# Altium schematic sheet micro.SchDoc
size A4; SheetNumber: 1; SheetTotal: 3
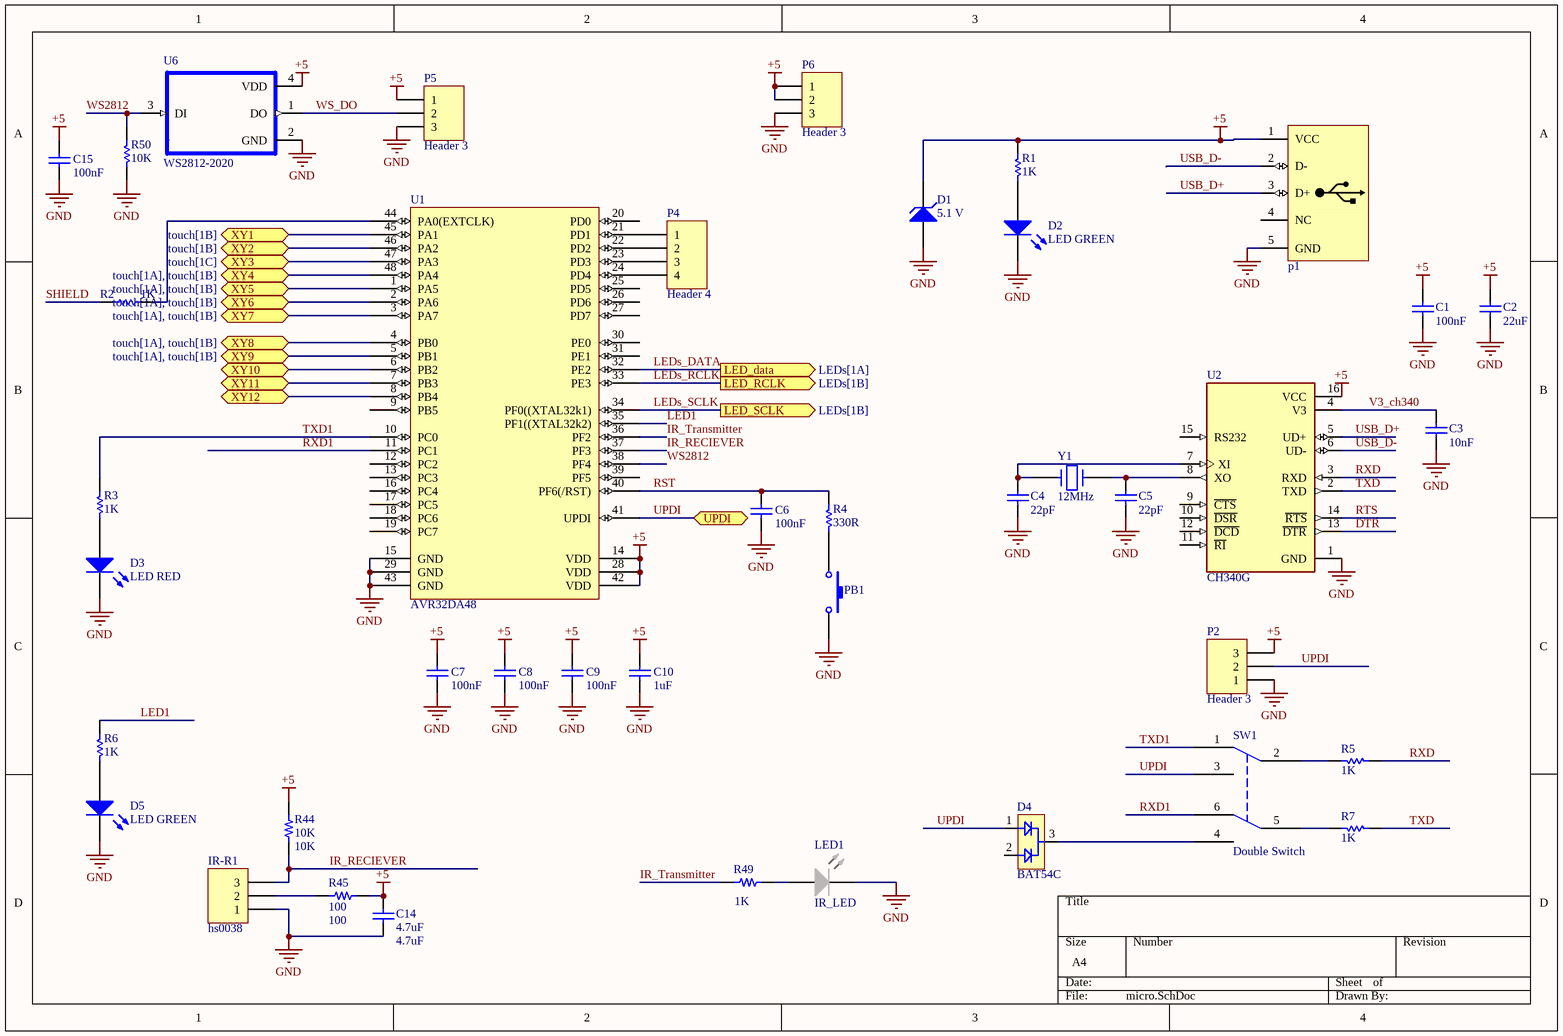
[diagram p0: micro.SchDoc]

## Parts
C1  100nF  [SMD_CAP_0805]
C2  22uF  [SMD_CAP_0805]
C3  10nF  [SMD_CAP_0805]
C4  22pF  [SMD_CAP_0805]
C5  22pF  [SMD_CAP_0805]
C6  value 100nF  [CAP0805]  (hidden comment: cap 100nF)
C7  value 100nF  [CAP0805]  (hidden comment: cap 100nF)
C8  value 100nF  [CAP0805]  (hidden comment: cap 100nF)
C9  value 100nF  [CAP0805]  (hidden comment: cap 100nF)
C10  value 1uF  [CAP0805]  (hidden comment: cap 1uF)
C14  4.7uF  [CAP0805]
C15  value 100nF  [CAP0805]  (hidden comment: cap 100nF)
D1  Voltage: 5.1 V  [Diode 1n4148 SMD]  (hidden comment: Diode Zener)
D2  LED GREEN  [LED_0805 G]
D3  LED RED  [LED_0805 G]
D4  BAT54C  [SOT-23]
D5  LED GREEN  [LED_0805 G]
IR-R1  hs0038  [HS3800B]
LED1  IR_LED  [LED_WHITE]
p1  USB Connector  [USB_AB_BM_SHS]  (value not drawn)
P2  Header 3  [HDR1X3]
P4  Header 4  [HDR1X4]
P5  Header 3  [HDR1X3]
P6  Header 3  [HDR1X3]
PB1  Push-Button-tall  [tack-sw-3x5x6]  (value not drawn)
R1  value 1K  [RES0805]  (hidden comment: Res 1K)
R2  1K  [RES 0805 (2012X06L)]
R3  value 1K  [RES0805]  (hidden comment: Res 1K)
R4  value 330R  [RES0805]  (hidden comment: Res 330R)
R5  value 1K  [RES0805]  (hidden comment: Res 1K)
R6  value 1K  [RES0805]  (hidden comment: Res 1K)
R7  value 1K  [RES0805]  (hidden comment: Res 1K)
R44  10K  [RES0805]
R45  100  [RES0805]
R49  1K  [RES0805]
R50  value 10K  [RES0805]  (hidden comment: Res 10K)
SW1  Double Switch  [switch_2way_DPDT_right]
U1  AVR32DA48  [TQPF48]
U2  CH340G  [SOIC16_N]
U6  WS2812-2020  [LED_WS2812B-5050]
Y1  12MHz  [XTAL_SMD]

## Ports
LED_data (out, see LEDs[1A]), LED_RCLK (out, see LEDs[1B]), LED_SCLK (out, see LEDs[1B]), UPDI (bidir), XY1 (bidir, see touch[1B]), XY2 (bidir, see touch[1B]), XY3 (bidir, see touch[1C]), XY4 (bidir, see touch[1A], touch[1B]), XY5 (bidir, see touch[1A], touch[1B]), XY6 (bidir, see touch[1A], touch[1B]), XY7 (bidir, see touch[1A], touch[1B]), XY8 (bidir, see touch[1A], touch[1B]), XY9 (bidir, see touch[1A], touch[1B]), XY10 (bidir), XY11 (bidir), XY12 (bidir)

## Nets
+5: C1.2 C2.2 C7.2 C8.2 C9.2 C10.2 C14.2 C15.2 D1.2(K) p1.1(VCC) P2.3 P5.1 P6.1 P6.2 R1.1 R44.1 R45.1 U1.14(VDD) U1.28(VDD) U1.42(VDD) U2.16(VCC) U6.4(VDD)
GND: C1.1 C2.1 C3.1 C4.1 C5.1 C6.1 C7.1 C8.1 C9.1 C10.1 C14.1 C15.1 D1.1(A) D2.2(K) D3.2(K) D5.2(K) IR-R1.1 LED1.K p1.5(GND) P2.1 P5.3 P6.3 PB1.1 R50.2 U1.15(GND) U1.29(GND) U1.43(GND) U2.1(GND) U6.2(GND)
DTR: U2.13(~{DTR})
IR_RECIEVER: IR-R1.3 R44.2 U1.37(PF3)
IR_Transmitter: R49.2 U1.36(PF2)
LED1: R6.1 U1.35(PF1((XTAL32k2))
LEDs_DATA: U1.32(PE2) ; port LED_data
LEDs_RCLK: U1.33(PE3) ; port LED_RCLK
LEDs_SCLK: U1.34(PF0((XTAL32k1)) ; port LED_SCLK
RST: C6.2 R4.1 U1.40(PF6(/RST))
RTS: U2.14(~{RTS})
RXD: R5.2 U2.3(RXD)
RXD1: SW1.6 U1.11(PC1)
SHIELD: R2.2
TXD: R7.2 U2.2(TXD)
TXD1: R3.1 SW1.1 U1.10(PC0)
UPDI: D4.1 P2.2 SW1.3 U1.41(UPDI) ; port UPDI
USB_D+: p1.3(D+) U2.5(UD+)
USB_D-: p1.2(D-) U2.6(UD-)
V3_ch340: C3.2 U2.4(V3)
WS2812: R50.1 U1.38(PF4) U6.3(DI)
WS_DO: P5.2 U6.1(DO)
XY1: U1.45(PA1) ; port XY1
XY2: U1.46(PA2) ; port XY2
XY3: U1.47(PA3) ; port XY3
XY4: U1.48(PA4) ; port XY4
XY5: U1.1(PA5) ; port XY5
XY6: U1.2(PA6) ; port XY6
XY7: U1.3(PA7) ; port XY7
XY8: U1.4(PB0) ; port XY8
XY9: U1.5(PB1) ; port XY9
XY10: U1.6(PB2) ; port XY10
XY11: U1.7(PB3) ; port XY11
XY12: U1.8(PB4) ; port XY12
NetC4_2: C4.2 U2.7(XI) Y1.1
NetC5_2: C5.2 U2.8(XO) Y1.2
NetD2_1: D2.1(A) R1.2
NetD3_1: D3.1(A) R3.2
NetD4_3: D4.3 SW1.4
NetD5_1: D5.1(A) R6.2
NetIR-R1_2: IR-R1.2 R45.2
NetLED1_A: LED1.A R49.1
NetP4_1: P4.1 U1.21(PD1)
NetP4_2: P4.2 U1.22(PD2)
NetP4_3: P4.3 U1.23(PD3)
NetP4_4: P4.4 U1.24(PD4)
NetPB1_2: PB1.2 R4.2
NetR2_1: R2.1 U1.44(PA0(EXTCLK))
NetR5_1: R5.1 SW1.2
NetR7_1: R7.1 SW1.5

Not connected (* = marked no-connect by the designer): D4 2; p1 4(NC); U1 9(PB5) 12(PC2) 13(PC3) 16(PC4) 17(PC5) 18(PC6) 19(PC7) 20(PD0) 25(PD5) 26(PD6) 27(PD7) 30(PE0) 31(PE1) 39(PF5); U2 9(~{CTS}) 10(~{DSR}) 11(~{RI}) 12(~{DCD}) 15(RS232)

## Library data of the parts
C1-C5 = Cap: CAP SMD 0805; Published: 8-Jun-2000; LatestRevisionDate: 17-Jul-2002; LatestRevisionNote: Re-released for DXP Platform.; PackageReference: RAD-0.3; Publisher: Altium Limited; PackageDescription: Radial Cap, Thru-Hole; 2 Leads; 0.3 in Pin Spacing
  C1: Value: 100nF
  C2: Value: 22uF
  C3: Value: 10nF
  C4 C5: Value: 22pF
C6-C10 C15 = Cap ceramic: CAP seramic
C14 = Cap: CAP SMD 0603; Published: 8-Jun-2000; LatestRevisionDate: 17-Jul-2002; LatestRevisionNote: Re-released for DXP Platform.; PackageReference: RAD-0.3; Publisher: Altium Limited; PackageDescription: Radial Cap, Thru-Hole; 2 Leads; 0.3 in Pin Spacing; Value: 4.7uF
D1 = Diode Zener: Zener Diode; Designer: Saeid Jorablo; Company: E.P.I.L; Design Date: 2011/11/02
D2 D5 = LED0: LED SMD 0805 GREEN; Published: 8-Jun-2000; LatestRevisionDate: 08-Jul-2005; LatestRevisionNote: Mech Layer 1 removed.; PackageReference: LED-0; Publisher: Altium Limited; PackageDescription: LED; 2 Leads
D3 = LED0: LED SMD 0805 RED; Published: 8-Jun-2000; LatestRevisionDate: 08-Jul-2005; LatestRevisionNote: Mech Layer 1 removed.; PackageReference: LED-0; Publisher: Altium Limited; PackageDescription: LED; 2 Leads
IR-R1 = Header 3H: Header, 3-Pin, Right Angle; LatestRevisionDate: 17-Jul-2002; LatestRevisionNote: Re-released for DXP Platform.; Publisher: Altium Limited
LED1 = LED-W
p1 = USB MICRO: USB Connector MICRO-B Type; Designer: ABBAS BASEREH; Max Current: 1600mA; Mounting Technology: Surface Mount\Through-Hole; Category: Connector; Pin Count: 5-7; Publisher: ABBAS BASEREH; Status: Unreleased; ComponentLink1Description: Datasheet; ComponentLink2Description: Reference; Update: 1395-11-17
P2 P5 P6 = Header 3: Header, 3-Pin; LatestRevisionDate: 17-Jul-2002; LatestRevisionNote: Re-released for DXP Platform.; Publisher: Altium Limited
P4 = Header 4: Header, 4-Pin; LatestRevisionDate: 17-Jul-2002; LatestRevisionNote: Re-released for DXP Platform.; Publisher: Altium Limited
R1-R7 R50 = Res1: Resistor; Published: 8-Jun-2000; LatestRevisionDate: 17-Jul-2002; LatestRevisionNote: Re-released for DXP Platform.; PackageReference: AXIAL-0.3; Publisher: Altium Limited; PackageDescription: Axial Device, Thru-Hole; 2 Leads; 0.3 in Pin Spacing
  R2: Value: 1K
R44 R45 R49 = Resistor: RES SMD 0603; Part Number: RCS0805100KFKEA
  R44: Value: 10K
  R45: Value: 100
  R49: Value: 1K
SW1 = Switch - DPDT: DPDT Switch
U2 = CH340G: USB Interface Integrated Circuit; MF: WCH; Price: None; SnapEDA_Link: https://www.snapeda.com/parts/Ch340G/WCH/view-part/?ref=snap; MP: Ch340G; Value: *; Availability: Not in stock; Package: None; Check_prices: https://www.snapeda.com/parts/Ch340G/WCH/view-part/?ref=eda
U6 = WS2812-2020: Intelligent control LED integrated light source; MF: Worldsemi; SnapEDA_Link: https://www.snapeda.com/parts/WS2812-2020/Worldsemi/view-part/2873751/?ref=snap; Package: Package Analog Devices; MP: WS2812-2020; Value: *; Availability: Unavailable; Price: None
Y1 = CRYSTAL